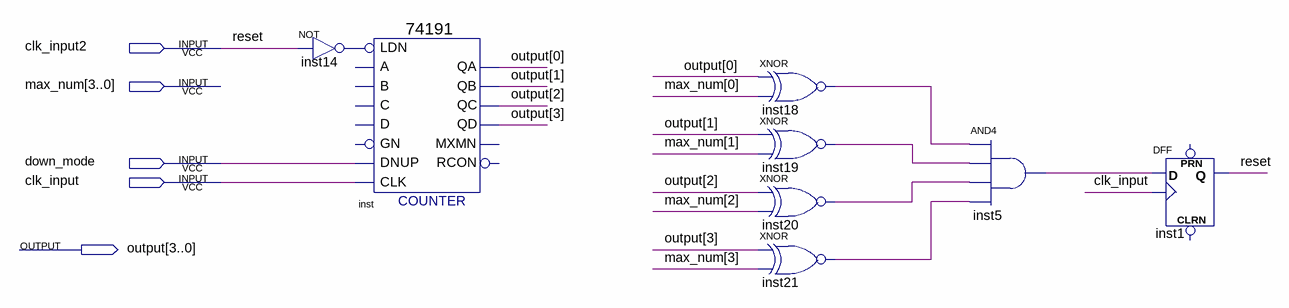
[diagram p0: schematic sheet]
// Quartus schematic 74191Counter.bdf as structural Verilog: 8 symbols, 5 pins
module \74191Counter  (
  input  clk_input2,
  input  [3:0] max_num,
  input  down_mode,
  input  clk_input,
  output [3:0] \output 
);

  wire inst5_out, inst14_out, inst18_out, inst19_out, inst20_out, inst21_out;

  \74191  inst (
    .LDN(inst14_out), .CLK(clk_input), .DNUP(down_mode), .QA(\output [0]), .QB(\output [1]),
    .QD(\output [3]), .QC(\output [2]));  // open: D, C, B, A, GN, RCON, MXMN
  not inst14 (inst14_out, clk_input2);
  xnor inst18 (inst18_out, \output [0], max_num[0]);
  xnor inst19 (inst19_out, \output [1], max_num[1]);
  xnor inst20 (inst20_out, \output [2], max_num[2]);
  xnor inst21 (inst21_out, \output [3], max_num[3]);
  and inst5 (inst5_out, inst18_out, inst19_out, inst20_out, inst21_out);
  DFF inst1 (.CLK(clk_input), .D(inst5_out), .Q(clk_input2));  // open: CLRN, PRN

  // Other names for the same wires on the sheet: reset = clk_input2
endmodule
